# Altium schematic sheet ciclo_V2.SchDoc
size A4; SheetNumber: 1; SheetTotal: 1
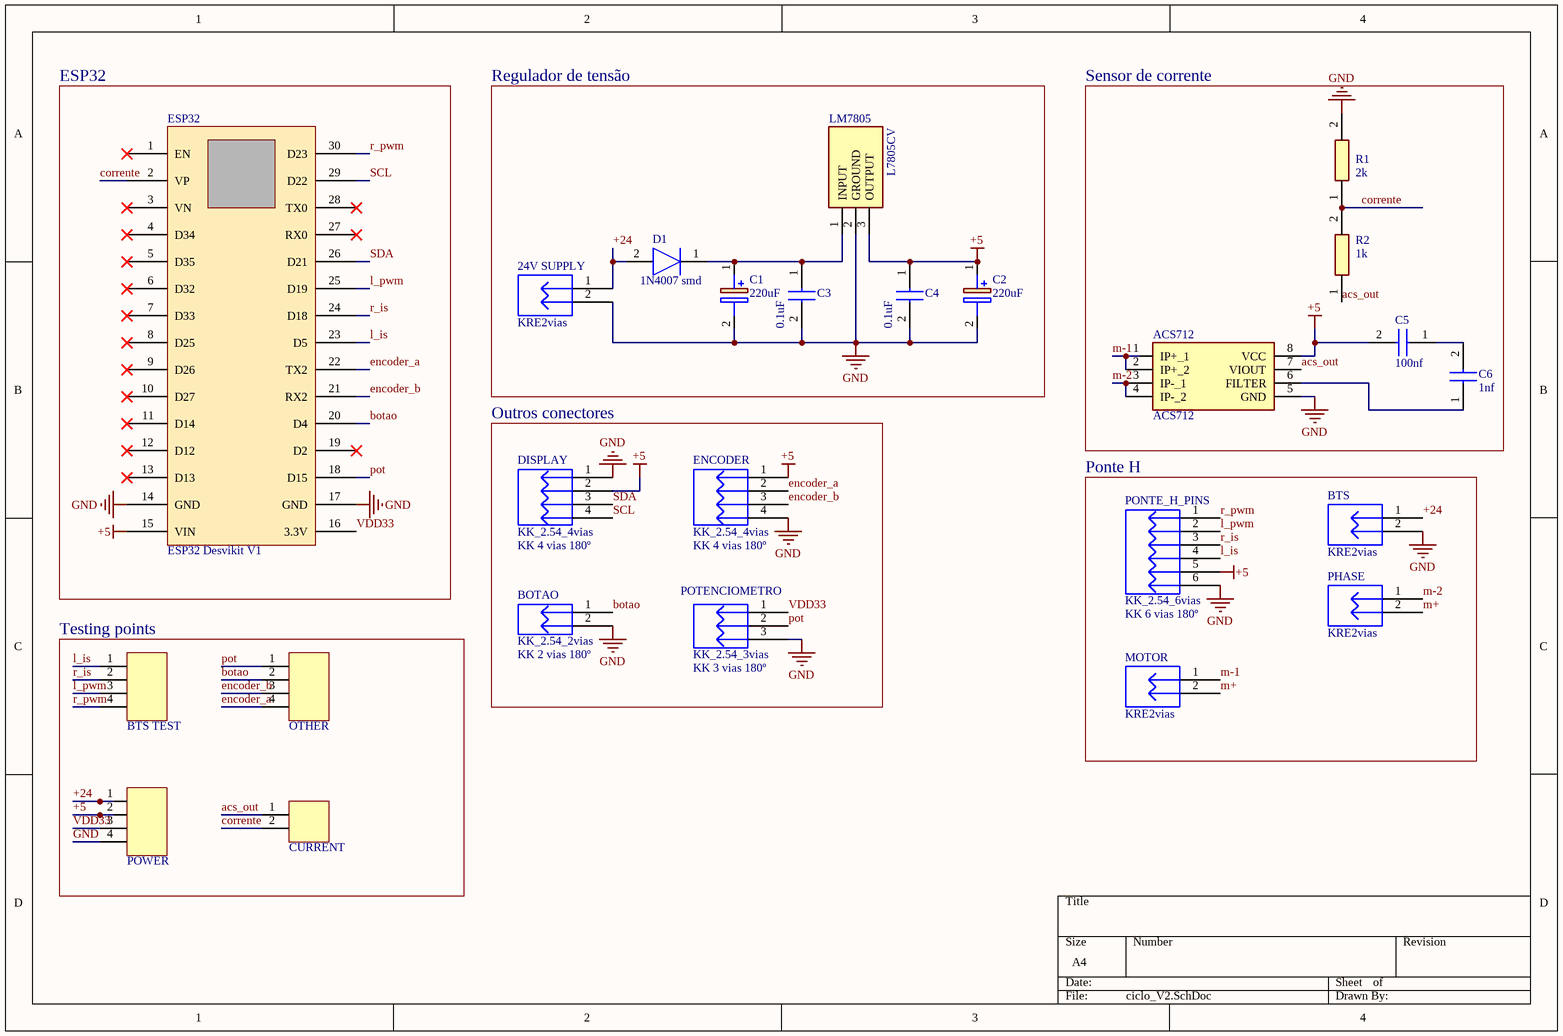
[diagram p0: ciclo_V2.SchDoc]

## Parts
24V_SUPPLY  KRE2vias  [KRE2-2vias]
ACS712  ACS712  [SOIC127P600X175-8N]
BOTAO  KK_2.54_2vias  Valor: KK 2 vias 180º  [KK_2VIAS_180]
BTS  KRE2vias  [KRE2-2vias]
BTS_TEST  Testing PADS 1x4  [Testing PADS 1x4]  (value not drawn)
C1  220uF  [CAPPRD200W55D500H1200]
C2  220uF  [CAPPRD200W55D500H1200]
C3  0.1uF  [CAPC3216X180N]
C4  0.1uF  [CAPC3216X180N]
C5  100nf  [CAPC3216X180N]
C6  1nf  [CAPC3216X180N]
CURRENT  Testing PADS 1x2  [Testing PADS 1x2]  (value not drawn)
D1  1N4007 smd  [DIOM5327X242N]
DISPLAY  KK_2.54_4vias  Valor: KK 4 vias 180º  [KK_4vias_180]
ENCODER  KK_2.54_4vias  Valor: KK 4 vias 180º  [KK_4vias_180]
ESP32  value ESP32 Desvikit V1  [ESP32_Desvikit_v1]  (hidden comment: microcontrolador)
LM7805  L7805CV  [TO255P460X1020X2008-3P]
MOTOR  KRE2vias  [KRE2-2vias]
OTHER  Testing PADS 1x4  [Testing PADS 1x4]  (value not drawn)
PHASE  KRE2vias  [KRE2-2vias]
PONTE_H_PINS  KK_2.54_6vias  Valor: KK 6 vias 180º  [KK_6vias_180]
POTENCIOMETRO  KK_2.54_3vias  Valor: KK 3 vias 180º  [KK_3vias_180]
POWER  Testing PADS 1x4  [Testing PADS 1x4]  (value not drawn)
R1  2k  [RESC3216X75N]
R2  1k  [RESC3216X75N]

## Blocks framed on the sheet
ESP32: ESP32
Regulador de tensão: 24V_SUPPLY C1-C4 D1 LM7805
Sensor de corrente: ACS712 C5 C6 R1 R2
Outros conectores: BOTAO DISPLAY ENCODER POTENCIOMETRO
Ponte H: BTS MOTOR PHASE PONTE_H_PINS
Testing points: BTS_TEST CURRENT OTHER POWER

## Nets
+5: ACS712.8(VCC) C2.1(+) C4.1 C5.2 DISPLAY.2 ENCODER.1 ESP32.15(VIN) LM7805.3(OUTPUT) PONTE_H_PINS.5 POWER.2
GND: 24V_SUPPLY.2 ACS712.5(GND) BOTAO.2 BTS.2 C1.2(-) C2.2(-) C3.2 C4.2 DISPLAY.1 ENCODER.4 ESP32.14(GND) ESP32.17(GND) LM7805.2(GROUND) PONTE_H_PINS.6 POTENCIOMETRO.3 POWER.4 R1.2
+24: 24V_SUPPLY.1 BTS.1 D1.2(A) POWER.1
acs_out: ACS712.7(VIOUT) CURRENT.1 R2.1
botao: BOTAO.1 ESP32.20(D4) OTHER.2
corrente: CURRENT.2 ESP32.2(VP) R1.1 R2.2
encoder_a: ENCODER.2 ESP32.22(TX2) OTHER.4
encoder_b: ENCODER.3 ESP32.21(RX2) OTHER.3
l_is: BTS_TEST.1 ESP32.23(D5) PONTE_H_PINS.4
l_pwm: BTS_TEST.3 ESP32.25(D19) PONTE_H_PINS.2
m+: MOTOR.2 PHASE.2
m-1: ACS712.1(IP+_1) ACS712.2(IP+_2) MOTOR.1
m-2: ACS712.3(IP-_1) ACS712.4(IP-_2) PHASE.1
pot: ESP32.18(D15) OTHER.1 POTENCIOMETRO.2
r_is: BTS_TEST.2 ESP32.24(D18) PONTE_H_PINS.3
r_pwm: BTS_TEST.4 ESP32.30(D23) PONTE_H_PINS.1
SCL: DISPLAY.4 ESP32.29(D22)
SDA: DISPLAY.3 ESP32.26(D21)
VDD33: ESP32.16(3.3V) POTENCIOMETRO.1 POWER.3
NetACS712_6: ACS712.6(FILTER) C6.1
NetC1_1: C1.1(+) C3.1 D1.1(K) LM7805.1(INPUT)
NetC5_1: C5.1 C6.2

Not connected (* = marked no-connect by the designer): ESP32 1(EN)* 3(VN)* 4(D34)* 5(D35)* 6(D32)* 7(D33)* 8(D25)* 9(D26)* 10(D27)* 11(D14)* 12(D12)* 13(D13)* 19(D2)* 27(RX0)* 28(TX0)*

## Library data of the parts
24V_SUPPLY BTS MOTOR PHASE = KRE2vias: Conector 2 vias; Descrição: Conector KRE 2 vias 180º; Encapsulamento: PTH - 180º; Modelo: 2 vias - 180º; Marca: *; Observação: *
ACS712 = ACS712: Sensor de corrente 20A; Manufacturer_Name: Sharp Microelectronics; Manufacturer_Part_Number: ACS712ELCTR-05B-T; Datasheet Link: https://www.allegromicro.com/~/media/Files/Datasheets/ACS712-Datasheet.ashx; Height: 1.75mm
BOTAO = KK_2.54_2vias: Conector KK 2.54mm 2 vias; Descrição: Conector KK 3 vias com passo 2.54mm; Encapsulamento: PTH - 180º; Modelo: 2 vias - 180º; Marca: *; Observação: *
BTS_TEST OTHER POWER = Testing PADS 1x4: Headers & Wire Housings 40Pin 2mm Spacing Single Row Hdrs, 5pc; Manufacturer: Cromax; Mounting Angle: Vertical; Number of Positions: 40 Position; Supplier 1: -; Manufacturer Part Number: -; RoHS: RoHS Compliant; Category: Headers & Wire Housings; Stock 1: 14; Pricing 1: 1=1.60, 2=0.80 (BRL); Accessory Type: -; Contact Plating: Gold; Contact Type: -; Number of Rows: 1 Row; Product: Headers; Termination Style: Through Hole; Type: Breakaway; Brand: Cromax; Mounting Style: Straight Pin; Pitch: 2 mm; Row Spacing: -; Contact Gender: Pin (Female); Product Category: Accessories; RoHS - Mouser: Y; Minimum Order Quantity: 1; Reeling: False; ComponentLink1URL: -; ComponentLink1Description: -; Supplier Part Number 1: -
C1 C2 = Capacitor eletrolítico D5mm: Capacitor Polarised; Manufacturer_Name: Panasonic; Manufacturer_Part_Number: ECA-0JM221; Datasheet Link: http://industrial.panasonic.com/cdbs/www-data/pdf/RDF0000/ABA0000C1218.pdf; Height: 12mm; Mouser Part Number: 667-ECA-0JM221; Mouser Price/Stock: https://www.mouser.com/Search/Refine.aspx?Keyword=667-ECA-0JM221; Arrow Part Number: ECA-0JM221; Arrow Price/Stock: https://www.arrow.com/en/products/eca-0jm221/panasonic
C3-C6 = GRM31CC80E227ME11L: Capacitor cerâmico SMD; Manufacturer_Name: Murata Electronics; Datasheet Link: https://datasheet.datasheetarchive.com/originals/distributors/DKDS-10/192368.pdf; Height: 1.8mm; Manufacturer_Part_Number: GRM31CC80E227ME11L; Mouser Part Number: 81-GRM31CC80E227ME1L; Mouser Price/Stock: https://www.mouser.com/Search/Refine.aspx?Keyword=81-GRM31CC80E227ME1L; Arrow Part Number: GRM31CC80E227ME11L; Arrow Price/Stock: https://www.arrow.com/en/products/grm31cc80e227me11l/murata-manufacturing
CURRENT = Testing PADS 1x2: Headers & Wire Housings 40Pin 2mm Spacing Single Row Hdrs, 5pc; Manufacturer: Cromax; Mounting Angle: Vertical; Number of Positions: 40 Position; Supplier 1: -; Manufacturer Part Number: -; RoHS: RoHS Compliant; Category: Headers & Wire Housings; Stock 1: 14; Pricing 1: 1=1.60, 2=0.80 (BRL); Accessory Type: -; Contact Plating: Gold; Contact Type: -; Number of Rows: 1 Row; Product: Headers; Termination Style: Through Hole; Type: Breakaway; Brand: Cromax; Mounting Style: Straight Pin; Pitch: 2 mm; Row Spacing: -; Contact Gender: Pin (Female); Product Category: Accessories; RoHS - Mouser: Y; Minimum Order Quantity: 1; Reeling: False; ComponentLink1URL: -; ComponentLink1Description: -; Supplier Part Number 1: -
D1 = 1N4007 smd: Diode smd; Manufacturer_Name: Shikues; Datasheet Link: https://datasheet.lcsc.com/szlcsc/SK-1N4007_C126233.pdf; Height: 2.42mm; Manufacturer_Part_Number: 1N4007
DISPLAY ENCODER = KK_2.54_4vias: Conector KK 2.54mm 4 vias; Descrição: Conector KK 3 vias com passo 2.54mm; Encapsulamento: PTH - 180º; Modelo: 3 vias - 180º; Marca: *; Observação: *
ESP32 = ESP32 Desvikit v1: microcontrolador com modulo bluetooth e wifi
LM7805 = L7805CV: Regulador de tensão para 5V; Manufacturer_Name: STMicroelectronics; Datasheet Link: http://www.st.com/web/en/resource/technical/document/datasheet/CD00000444.pdf; Height: 4.6mm; Manufacturer_Part_Number: L7805CV; Mouser Part Number: 511-L7805CV; Mouser Price/Stock: https://www.mouser.co.uk/ProductDetail/STMicroelectronics/L7805CV?qs=9NrABl3fj%2FqplZAHiYUxWg%3D%3D; Arrow Part Number: L7805CV; Arrow Price/Stock: https://www.arrow.com/en/products/l7805cv/stmicroelectronics?region=europe
PONTE_H_PINS = KK_2.54_6vias: Conector KK 2.54mm 6 vias; Descrição: Conector KK 3 vias com passo 2.54mm; Encapsulamento: PTH - 180º; Modelo: 3 vias - 180º; Marca: *; Observação: *
POTENCIOMETRO = KK_2.54_3vias: Conector KK 2.54mm 3 vias; Descrição: Conector KK 3 vias com passo 2.54mm; Encapsulamento: PTH - 180º; Modelo: 3 vias - 180º; Marca: *; Observação: *
R1 R2 = CR1206: Resistor SMD 1206; Manufacturer_Name: Bourns; Manufacturer_Part_Number: CR1206-F/-2R00ELF; Height: 0.75mm; Mouser Part Number: 652-CR1206-F/2R00ELF; Mouser Price/Stock: https://www.mouser.co.uk/ProductDetail/Bourns/CR1206-F-2R00ELF?qs=W%2FMpXkg%252BdQ47Z%2FeZv1nDSg%3D%3D